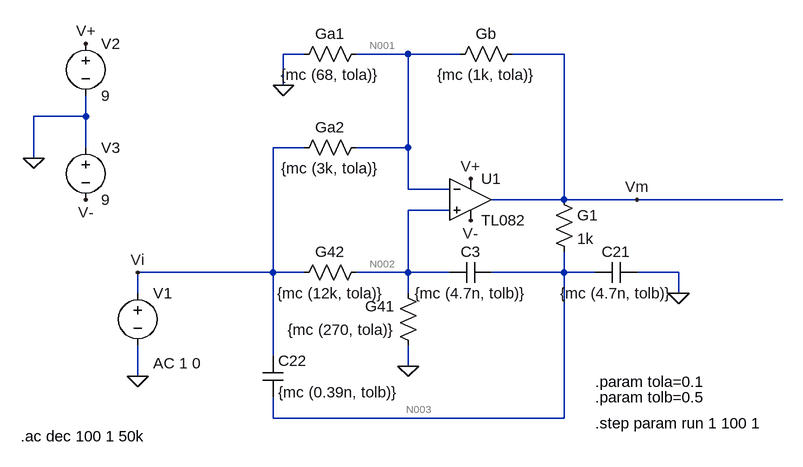
[diagram p0: schematic Draft1.asc]
Draft1.asc, the LTspice schematic file:
Version 4
SHEET 1 1284 680
WIRE -96 -112 -128 -112
WIRE 64 -112 -16 -112
WIRE 144 -112 64 -112
WIRE 304 -112 224 -112
WIRE -128 -64 -128 -112
WIRE -432 -16 -432 -48
WIRE -432 -16 -512 -16
WIRE -432 32 -432 -16
WIRE -96 32 -144 32
WIRE 64 32 64 -112
WIRE 64 32 -16 32
WIRE -512 48 -512 -16
WIRE 64 96 64 32
WIRE 128 96 64 96
WIRE 304 112 304 -112
WIRE 304 112 192 112
WIRE 416 112 304 112
WIRE 640 112 416 112
WIRE 128 128 64 128
WIRE -144 224 -144 32
WIRE -144 224 -352 224
WIRE -96 224 -144 224
WIRE 64 224 64 128
WIRE 64 224 -16 224
WIRE 128 224 64 224
WIRE 304 224 304 192
WIRE 304 224 192 224
WIRE 352 224 304 224
WIRE 480 224 416 224
WIRE -352 256 -352 224
WIRE 64 256 64 224
WIRE 480 256 480 224
WIRE -144 352 -144 224
WIRE 64 368 64 336
WIRE -352 384 -352 336
WIRE -144 448 -144 416
WIRE 304 448 304 224
WIRE 304 448 -144 448
FLAG 64 368 0
FLAG -128 -64 0
FLAG 480 256 0
FLAG -352 384 0
FLAG -512 48 0
FLAG -352 224 Vi
FLAG 416 112 Vm
FLAG 160 80 V+
FLAG -432 -128 V+
FLAG -432 112 V-
FLAG 160 144 V-
SYMBOL res 0 208 R90
WINDOW 0 0 56 VBottom 2
WINDOW 3 32 56 VTop 2
SYMATTR InstName G42
SYMATTR Value {mc (12k, tola)}
SYMBOL res 80 352 R180
WINDOW 0 36 76 Left 2
WINDOW 3 36 40 Left 2
SYMATTR InstName G41
SYMATTR Value {mc (270, tola)}
SYMBOL res -112 48 R270
WINDOW 0 32 56 VTop 2
WINDOW 3 0 56 VBottom 2
SYMATTR InstName Ga2
SYMATTR Value {mc (3k, tola)}
SYMBOL res -112 -96 R270
WINDOW 0 32 56 VTop 2
WINDOW 3 0 56 VBottom 2
SYMATTR InstName Ga1
SYMATTR Value {mc (68, tola)}
SYMBOL res 128 -96 R270
WINDOW 0 32 56 VTop 2
WINDOW 3 0 56 VBottom 2
SYMATTR InstName Gb
SYMATTR Value {mc (1k, tola)}
SYMBOL res 288 96 R0
SYMATTR InstName G1
SYMATTR Value 1k
SYMBOL PAULOlib\\TL082 160 48 R0
SYMATTR InstName U1
SYMBOL cap 192 208 R90
WINDOW 0 0 32 VBottom 2
WINDOW 3 32 32 VTop 2
SYMATTR InstName C3
SYMATTR Value {mc (4.7n, tolb)}
SYMBOL cap -160 352 R0
SYMATTR InstName C22
SYMATTR Value {mc (0.39n, tolb)}
SYMBOL cap 416 208 R90
WINDOW 0 0 32 VBottom 2
WINDOW 3 32 32 VTop 2
SYMATTR InstName C21
SYMATTR Value {mc (4.7n, tolb)}
SYMBOL voltage -352 240 R0
WINDOW 123 24 124 Left 2
WINDOW 39 0 0 Left 0
SYMATTR InstName V1
SYMATTR Value ""
SYMATTR Value2 AC 1 0
SYMBOL voltage -432 -144 R0
WINDOW 123 0 0 Left 0
WINDOW 39 0 0 Left 0
SYMATTR InstName V2
SYMATTR Value 9
SYMBOL voltage -432 16 R0
WINDOW 123 0 0 Left 0
WINDOW 39 0 0 Left 0
SYMATTR InstName V3
SYMATTR Value 9
TEXT 352 392 Left 2 !.param tola=0.1
TEXT 352 416 Left 2 !.param tolb=0.5
TEXT 352 456 Left 2 !.step param run 1 100 1
TEXT -532 476 Left 2 !.ac dec 100 1 50k

The netlist it stands for:
* Draft1.asc
R§G42 N002 Vi {mc (12k, tola)}
R§G41 0 N002 {mc (270, tola)}
R§Ga2 Vi N001 {mc (3k, tola)}
R§Ga1 0 N001 {mc (68, tola)}
R§Gb N001 Vm {mc (1k, tola)}
R§G1 Vm N003 1k
* U1: TL082 (symbol PAULOlib\TL082 not available, pins judged from their places): In+=N002 In-=N001 V+=V+ V-=V- OUT=Vm
C3 N003 N002 {mc (4.7n, tolb)}
C22 Vi N003 {mc (0.39n, tolb)}
C21 0 N003 {mc (4.7n, tolb)}
V1 Vi 0 AC 1 0
V2 V+ 0 9
V3 0 V- 9
.param tola=0.1
.param tolb=0.5
.step param run 1 100 1
.ac dec 100 1 50k
.backanno
.end

* Results of the author's LTspice run, read from the files saved beside the schematic
* Operating Point (first step), zero values left out:
*   run = 1 
*   V(n002) = -10.41 nV
*   V(n001) = 10.96 µV
*   V(vm) = 169.3 µV
*   V(n003) = 169.3 µV
*   V(v-) = -9 V
*   V(v+) = 9 V
*   I(Gb) = -155.7 nA
*   I(Ga1) = -151.8 nA
*   I(Ga2) = -3.892 nA
*   I(G41) = 38.09 pA
*   I(V3) = -8.595 mA
*   I(V2) = -8.594 mA
*   I(V1) = 3.891 nA
*   Ix(u1:1) = 39.05 pA
*   Ix(u1:2) = 39.05 pA
*   Ix(u1:3) = 8.594 mA
*   Ix(u1:4) = -8.595 mA
*   Ix(u1:5) = -155.7 nA